# Altium schematic sheet TwoWires.SchDoc
size Letter; Author: Adam Gilbert; CompanyName: McGill University; DrawnBy: Adam Gilbert; Organization: Altium Limited; Address1: McGill Cosmology; Address2: 3600 University Street; Address3: Montreal, Quebec; Address4: Canada; DocumentNumber: 4; Revision: Rev2; SheetNumber: 4; SheetTotal: 16; ProjectTitle: DfMux FMC Mezz; ModelNumber: MGMEZZ04; ProjectName: DfMux FMC Mezz
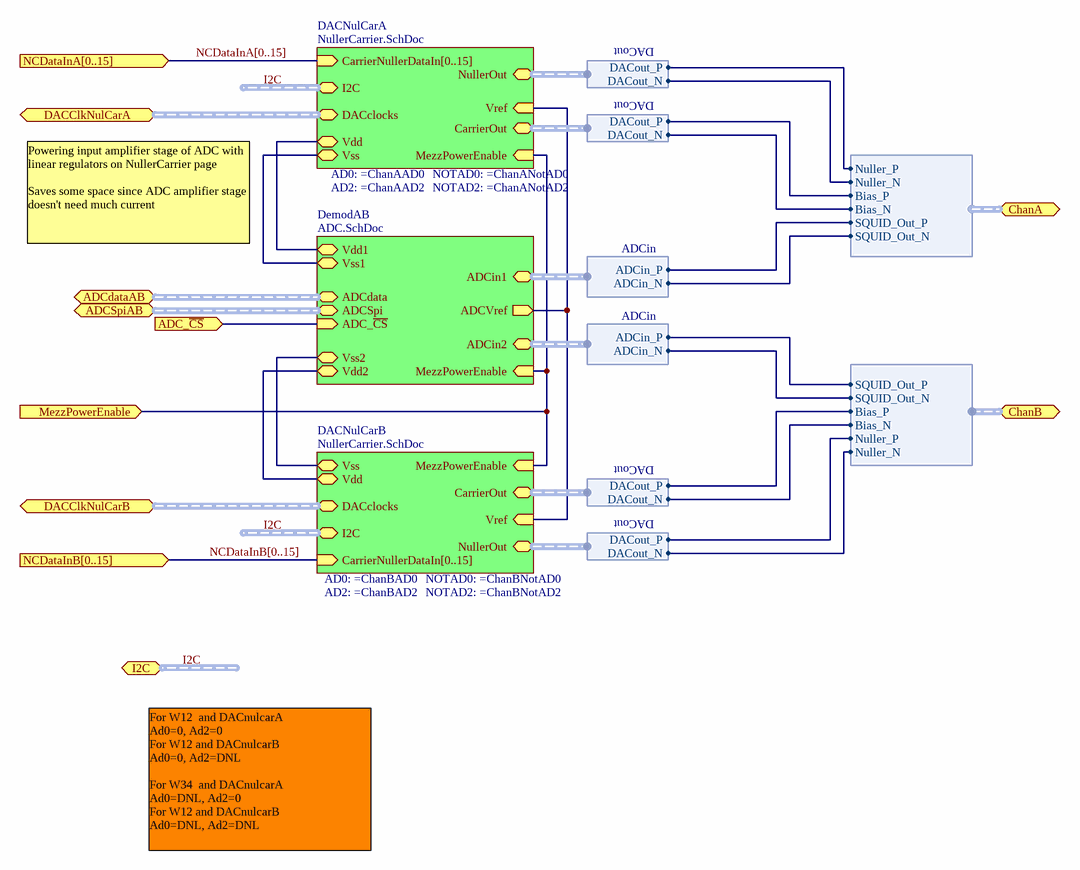
[diagram p0: TwoWires.SchDoc]

## Sub-sheets
DACNulCarA = NullerCarrier.SchDoc: NullerOut (harness DACout), CarrierOut (harness DACout), DACclocks (harness DACclks), Vdd, Vss, CarrierNullerDataIn[0..15] (in), I2C (harness I2C), MezzPowerEnable (in), Vref (in)  | NOTAD0: =ChanANotAD0; NOTAD2: =ChanANotAD2; AD0: =ChanAAD0; AD2: =ChanAAD2
DACNulCarB = NullerCarrier.SchDoc: NullerOut (harness DACout), CarrierOut (harness DACout), DACclocks (harness DACclks), Vdd, Vss, CarrierNullerDataIn[0..15] (in), I2C (harness I2C), MezzPowerEnable (in), Vref (in)  | NOTAD0: =ChanBNotAD0; NOTAD2: =ChanBNotAD2; AD0: =ChanBAD0; AD2: =ChanBAD2
DemodAB = ADC.SchDoc: ADCin1 (harness ADCin), ADCin2 (harness ADCin), ADCSpi (harness ADCSPI), ADCdata (harness ADCData), Vdd1, Vss1, Vdd2, Vss2, ADC_~{CS} (in), MezzPowerEnable (in), ADCVref (out)

## Ports
ADC_~{CS} (in), ADCdataAB (harness ADCData), ADCSpiAB (harness ADCSPI), ChanA (harness SQUID_CH_OUT), ChanB (harness SQUID_CH_OUT), DACClkNulCarA (harness DACclks), DACClkNulCarB (harness DACclks), I2C (harness I2C), MezzPowerEnable (in), NCDataInA[0..15] (in), NCDataInB[0..15] (in)

## Harnesses
DACout: DACout_N, DACout_P
SQUID_CH_OUT: Bias_P, Bias_N, Nuller_P, Nuller_N, SQUID_Out_P, SQUID_Out_N
ADCin: ADCin_P, ADCin_N

## Nets
ADC_~{CS}: port ADC_~{CS}, sheet DemodAB/ADC_~{CS}
MezzPowerEnable: port MezzPowerEnable, sheet DACNulCarA/MezzPowerEnable, sheet DemodAB/MezzPowerEnable, sheet DACNulCarB/MezzPowerEnable
(unnamed): sheet DACNulCarA/Vdd, sheet DemodAB/Vdd1
(unnamed): sheet DACNulCarA/Vss, sheet DemodAB/Vss1
(unnamed): sheet DACNulCarA/Vref, sheet DemodAB/ADCVref, sheet DACNulCarB/Vref
(unnamed): sheet DemodAB/Vdd2, sheet DACNulCarB/Vdd
(unnamed): sheet DemodAB/Vss2, sheet DACNulCarB/Vss
(unnamed): sheet DACNulCarA/NullerOut.DACout_N, port ChanA.Nuller_N
(unnamed): sheet DACNulCarA/NullerOut.DACout_P, port ChanA.Nuller_P
(unnamed): sheet DACNulCarA/CarrierOut.DACout_N, port ChanA.Bias_N
(unnamed): sheet DACNulCarA/CarrierOut.DACout_P, port ChanA.Bias_P
(unnamed): sheet DACNulCarB/CarrierOut.DACout_N, port ChanB.Bias_N
(unnamed): sheet DACNulCarB/CarrierOut.DACout_P, port ChanB.Bias_P
(unnamed): sheet DACNulCarB/NullerOut.DACout_N, port ChanB.Nuller_N
(unnamed): sheet DACNulCarB/NullerOut.DACout_P, port ChanB.Nuller_P
(unnamed): port ChanA.SQUID_Out_P, sheet DemodAB/ADCin1.ADCin_P
(unnamed): port ChanA.SQUID_Out_N, sheet DemodAB/ADCin1.ADCin_N
(unnamed): sheet DemodAB/ADCin2.ADCin_P, port ChanB.SQUID_Out_P
(unnamed): sheet DemodAB/ADCin2.ADCin_N, port ChanB.SQUID_Out_N

## Buses and harness runs
bus NCDataInA[0..15] = port NCDataInA[0..15] = sheet DACNulCarA/CarrierNullerDataIn[0..15]
bus NCDataInB[0..15] = port NCDataInB[0..15] = sheet DACNulCarB/CarrierNullerDataIn[0..15]
harness I2C = port I2C
harness I2C = sheet DACNulCarA/I2C
harness I2C = sheet DACNulCarB/I2C
harness port ADCdataAB = sheet DemodAB/ADCdata
harness port ADCSpiAB = sheet DemodAB/ADCSpi
harness port DACClkNulCarA = sheet DACNulCarA/DACclocks
harness port DACClkNulCarB = sheet DACNulCarB/DACclocks

## Notes on the sheet
- Powering input amplifier stage of ADC with linear regulators on NullerCarrier page
  Saves some space since ADC amplifier stage doesn't need much current
- For W12  and DACnulcarA
  Ad0=0, Ad2=0
  For W12 and DACnulcarB
  Ad0=0, Ad2=DNL
  For W34  and DACnulcarA
  Ad0=DNL, Ad2=0
  For W12 and DACnulcarB
  Ad0=DNL, Ad2=DNL
- File:
- Size:
- Date:
- Letter
- Revision:
- Sheet
- of
- Cosmology
- Drawn by: